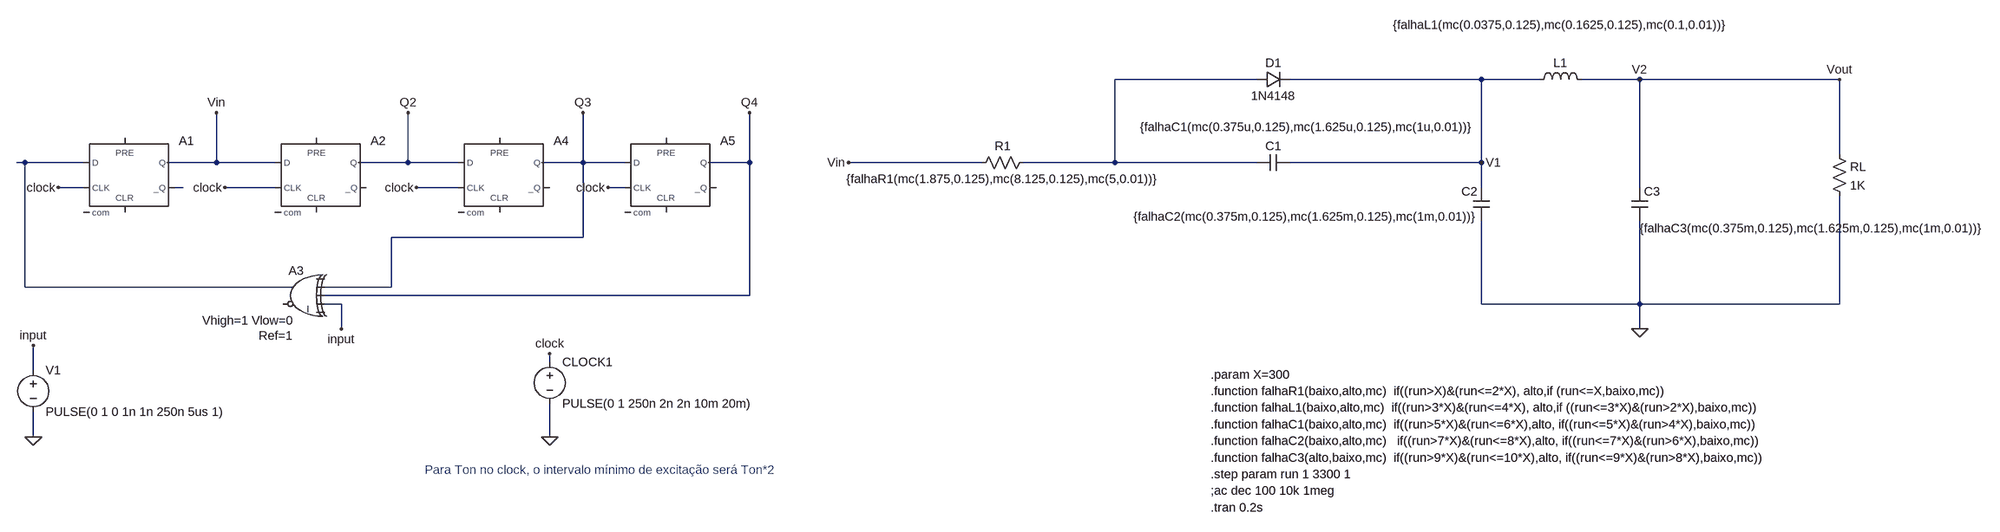
[diagram p0: schematic Nonlinear Rectfier + 4bit PRBS [FALHA] - 300 - 0.2s.asc]
Nonlinear Rectfier + 4bit PRBS [FALHA] - 300 - 0.2s.asc, the LTspice schematic file:
Version 4
SHEET 1 1180196 680
WIRE 1178704 -136832 1178432 -136832
WIRE 1179136 -136832 1178768 -136832
WIRE 1179248 -136832 1179136 -136832
WIRE 1179440 -136832 1179328 -136832
WIRE 1179824 -136832 1179440 -136832
WIRE 1179824 -136688 1179824 -136832
WIRE 1175856 -136672 1175840 -136672
WIRE 1175968 -136672 1175856 -136672
WIRE 1176224 -136672 1176224 -136768
WIRE 1176224 -136672 1176128 -136672
WIRE 1176336 -136672 1176224 -136672
WIRE 1176592 -136672 1176592 -136768
WIRE 1176592 -136672 1176496 -136672
WIRE 1176688 -136672 1176592 -136672
WIRE 1176928 -136672 1176928 -136768
WIRE 1176928 -136672 1176848 -136672
WIRE 1177008 -136672 1176928 -136672
WIRE 1177248 -136672 1177248 -136768
WIRE 1177248 -136672 1177168 -136672
WIRE 1178176 -136672 1177920 -136672
WIRE 1178432 -136672 1178432 -136832
WIRE 1178432 -136672 1178256 -136672
WIRE 1178704 -136672 1178432 -136672
WIRE 1179136 -136672 1179136 -136832
WIRE 1179136 -136672 1178768 -136672
WIRE 1175968 -136624 1175920 -136624
WIRE 1176160 -136624 1176144 -136624
WIRE 1176336 -136624 1176240 -136624
WIRE 1176688 -136624 1176608 -136624
WIRE 1177008 -136624 1176976 -136624
WIRE 1179136 -136624 1179136 -136672
WIRE 1179440 -136624 1179440 -136832
WIRE 1176928 -136528 1176928 -136672
WIRE 1176928 -136528 1176560 -136528
WIRE 1175856 -136432 1175856 -136672
WIRE 1176368 -136432 1175856 -136432
WIRE 1176560 -136432 1176560 -136528
WIRE 1176560 -136432 1176432 -136432
WIRE 1177248 -136416 1177248 -136672
WIRE 1177248 -136416 1176432 -136416
WIRE 1176464 -136400 1176432 -136400
WIRE 1179136 -136400 1179136 -136560
WIRE 1179440 -136400 1179440 -136560
WIRE 1179440 -136400 1179136 -136400
WIRE 1179824 -136400 1179824 -136608
WIRE 1179824 -136400 1179440 -136400
WIRE 1176464 -136352 1176464 -136400
WIRE 1179440 -136352 1179440 -136400
WIRE 1176864 -136288 1176864 -136304
WIRE 1175872 -136272 1175872 -136320
WIRE 1175872 -136144 1175872 -136192
WIRE 1176864 -136144 1176864 -136208
FLAG 1179440 -136352 0
FLAG 1179824 -136832 Vout
FLAG 1179136 -136672 V1
FLAG 1177920 -136672 Vin
FLAG 1176864 -136144 0
FLAG 1175920 -136624 clock
FLAG 1176864 -136304 clock
FLAG 1176240 -136624 clock
FLAG 1175872 -136144 0
FLAG 1175872 -136320 input
FLAG 1176608 -136624 clock
FLAG 1176224 -136768 Vin
FLAG 1176592 -136768 Q2
FLAG 1176928 -136768 Q3
FLAG 1177248 -136768 Q4
FLAG 1176976 -136624 clock
FLAG 1176464 -136352 input
FLAG 1179440 -136832 V2
SYMBOL res 1178160 -136656 R270
WINDOW 0 32 56 VTop 2
WINDOW 3 0 56 VBottom 2
SYMATTR InstName R1
SYMATTR Value {falhaR1(mc(1.875,0.125),mc(8.125,0.125),mc(5,0.01))}
SYMBOL cap 1178768 -136688 R90
WINDOW 0 0 32 VBottom 2
WINDOW 3 -68 -32 VTop 2
SYMATTR InstName C1
SYMATTR Value {falhaC1(mc(0.375u,0.125),mc(1.625u,0.125),mc(1u,0.01))}
SYMBOL cap 1179152 -136560 R180
WINDOW 0 24 56 Left 2
WINDOW 3 24 8 Left 2
SYMATTR InstName C2
SYMATTR Value {falhaC2(mc(0.375m,0.125),mc(1.625m,0.125),mc(1m,0.01))}
SYMBOL ind 1179232 -136816 R270
WINDOW 0 32 56 VTop 2
WINDOW 3 137 56 VBottom 2
SYMATTR InstName L1
SYMATTR Value {falhaL1(mc(0.0375,0.125),mc(0.1625,0.125),mc(0.1,0.01))}
SYMBOL cap 1179424 -136624 R0
WINDOW 3 16 79 Left 2
SYMATTR Value {falhaC3(mc(0.375m,0.125),mc(1.625m,0.125),mc(1m,0.01))}
SYMATTR InstName C3
SYMBOL res 1179808 -136704 R0
SYMATTR InstName RL
SYMATTR Value 1K
SYMBOL diode 1178704 -136816 R270
WINDOW 0 32 32 VTop 2
WINDOW 3 0 32 VBottom 2
SYMATTR InstName D1
SYMATTR Value 1N4148
SYMBOL voltage 1176864 -136304 R0
WINDOW 123 0 0 Left 2
WINDOW 39 0 0 Left 2
SYMATTR InstName CLOCK1
SYMATTR Value PULSE(0 1 250n 2n 2n 10m 20m)
SYMBOL Digital\\dflop 1176048 -136720 R0
WINDOW 3 0 0 Invisible 2
SYMATTR Value td=20n
SYMATTR InstName A1
SYMATTR Value2 Ref=1 Vhigh=10 Vlow=0
SYMBOL Digital\\dflop 1176416 -136720 R0
WINDOW 3 0 0 Invisible 2
SYMATTR Value Ref=1 Vhigh=3 Vlow=0
SYMATTR InstName A2
SYMATTR Value2 td=20n
SYMBOL Digital\\xor 1176384 -136480 M0
WINDOW 3 14 141 Left 2
WINDOW 123 12 112 Left 2
SYMATTR Value Ref=1
SYMATTR Value2 Vhigh=1 Vlow=0
SYMATTR InstName A3
SYMATTR SpiceLine2 tripdt=5n
SYMATTR SpiceLine Td=5n
SYMBOL Digital\\dflop 1176768 -136720 R0
WINDOW 3 0 0 Invisible 2
SYMATTR Value Ref=1 Vhigh=2 Vlow=0
SYMATTR InstName A4
SYMATTR Value2 td=20n
SYMBOL Digital\\dflop 1177088 -136720 R0
WINDOW 3 0 0 Invisible 2
SYMATTR Value Ref=1 Vhigh=10 Vlow=0
SYMATTR InstName A5
SYMATTR Value2 td=20n
SYMBOL voltage 1175872 -136288 R0
WINDOW 123 0 0 Left 2
WINDOW 39 0 0 Left 2
SYMATTR InstName V1
SYMATTR Value PULSE(0 1 0 1n 1n 250n 5us 1)
TEXT 1178616 -136040 Left 2 !;ac dec 100 10k 1meg
TEXT 1178616 -136072 Left 2 !.step param run 1 3300 1
TEXT 1178616 -136008 Left 2 !.tran 0.2s
TEXT 1178616 -136232 Left 2 !.function falhaR1(baixo,alto,mc)  if((run>X)&(run<=2*X), alto,if (run<=X,baixo,mc))
TEXT 1178616 -136200 Left 2 !.function falhaL1(baixo,alto,mc)  if((run>3*X)&(run<=4*X), alto,if ((run<=3*X)&(run>2*X),baixo,mc))
TEXT 1178616 -136136 Left 2 !.function falhaC2(baixo,alto,mc)   if((run>7*X)&(run<=8*X),alto, if((run<=7*X)&(run>6*X),baixo,mc))
TEXT 1178616 -136168 Left 2 !.function falhaC1(baixo,alto,mc)  if((run>5*X)&(run<=6*X),alto, if((run<=5*X)&(run>4*X),baixo,mc))
TEXT 1178616 -136264 Left 2 !.param X=300
TEXT 1178616 -136104 Left 2 !.function falhaC3(alto,baixo,mc)  if((run>9*X)&(run<=10*X),alto, if((run<=9*X)&(run>8*X),baixo,mc))
TEXT 1176624 -136080 Left 2 ;Para Ton no clock, o intervalo mínimo de excitação será Ton*2

The netlist it stands for:
* Nonlinear Rectfier + 4bit PRBS [FALHA] - 300 - 0.2s.asc
R1 Vin N001 {falhaR1(mc(1.875,0.125),mc(8.125,0.125),mc(5,0.01))}
C1 V1 N001 {falhaC1(mc(0.375u,0.125),mc(1.625u,0.125),mc(1u,0.01))}
C2 0 V1 {falhaC2(mc(0.375m,0.125),mc(1.625m,0.125),mc(1m,0.01))}
L1 V1 V2 {falhaL1(mc(0.0375,0.125),mc(0.1625,0.125),mc(0.1,0.01))}
C3 V2 0 {falhaC3(mc(0.375m,0.125),mc(1.625m,0.125),mc(1m,0.01))}
RL V2 0 1K
D1 N001 V1 1N4148
V§CLOCK1 clock 0 PULSE(0 1 250n 2n 2n 10m 20m)
A1 N002 0 clock 0 0 N003 Vin 0 DFLOP td=20n Ref=1 Vhigh=10 Vlow=0
A2 Vin 0 clock 0 0 0 Q2 0 DFLOP Ref=1 Vhigh=3 Vlow=0 td=20n
A3 0 Q3 Q4 input 0 0 N002 0 XOR Ref=1 Vhigh=1 Vlow=0 Td=5n tripdt=5n
A4 Q2 0 clock 0 0 0 Q3 0 DFLOP Ref=1 Vhigh=2 Vlow=0 td=20n
A5 Q3 0 clock 0 0 0 Q4 0 DFLOP Ref=1 Vhigh=10 Vlow=0 td=20n
V1 input 0 PULSE(0 1 0 1n 1n 250n 5us 1)
.model D D
.lib standard.dio
;ac dec 100 10k 1meg
.step param run 1 3300 1
.tran 0.2s
.function falhaR1(baixo,alto,mc)  if((run>X)&(run<=2*X), alto,if (run<=X,baixo,mc))
.function falhaL1(baixo,alto,mc)  if((run>3*X)&(run<=4*X), alto,if ((run<=3*X)&(run>2*X),baixo,mc))
.function falhaC2(baixo,alto,mc)   if((run>7*X)&(run<=8*X),alto, if((run<=7*X)&(run>6*X),baixo,mc))
.function falhaC1(baixo,alto,mc)  if((run>5*X)&(run<=6*X),alto, if((run<=5*X)&(run>4*X),baixo,mc))
.param X=300
.function falhaC3(alto,baixo,mc)  if((run>9*X)&(run<=10*X),alto, if((run<=9*X)&(run>8*X),baixo,mc))
* Para Ton no clock, o intervalo mínimo de excitação será Ton*2
.backanno
.end